# Altium schematic sheet schematic.SchDoc
size A4
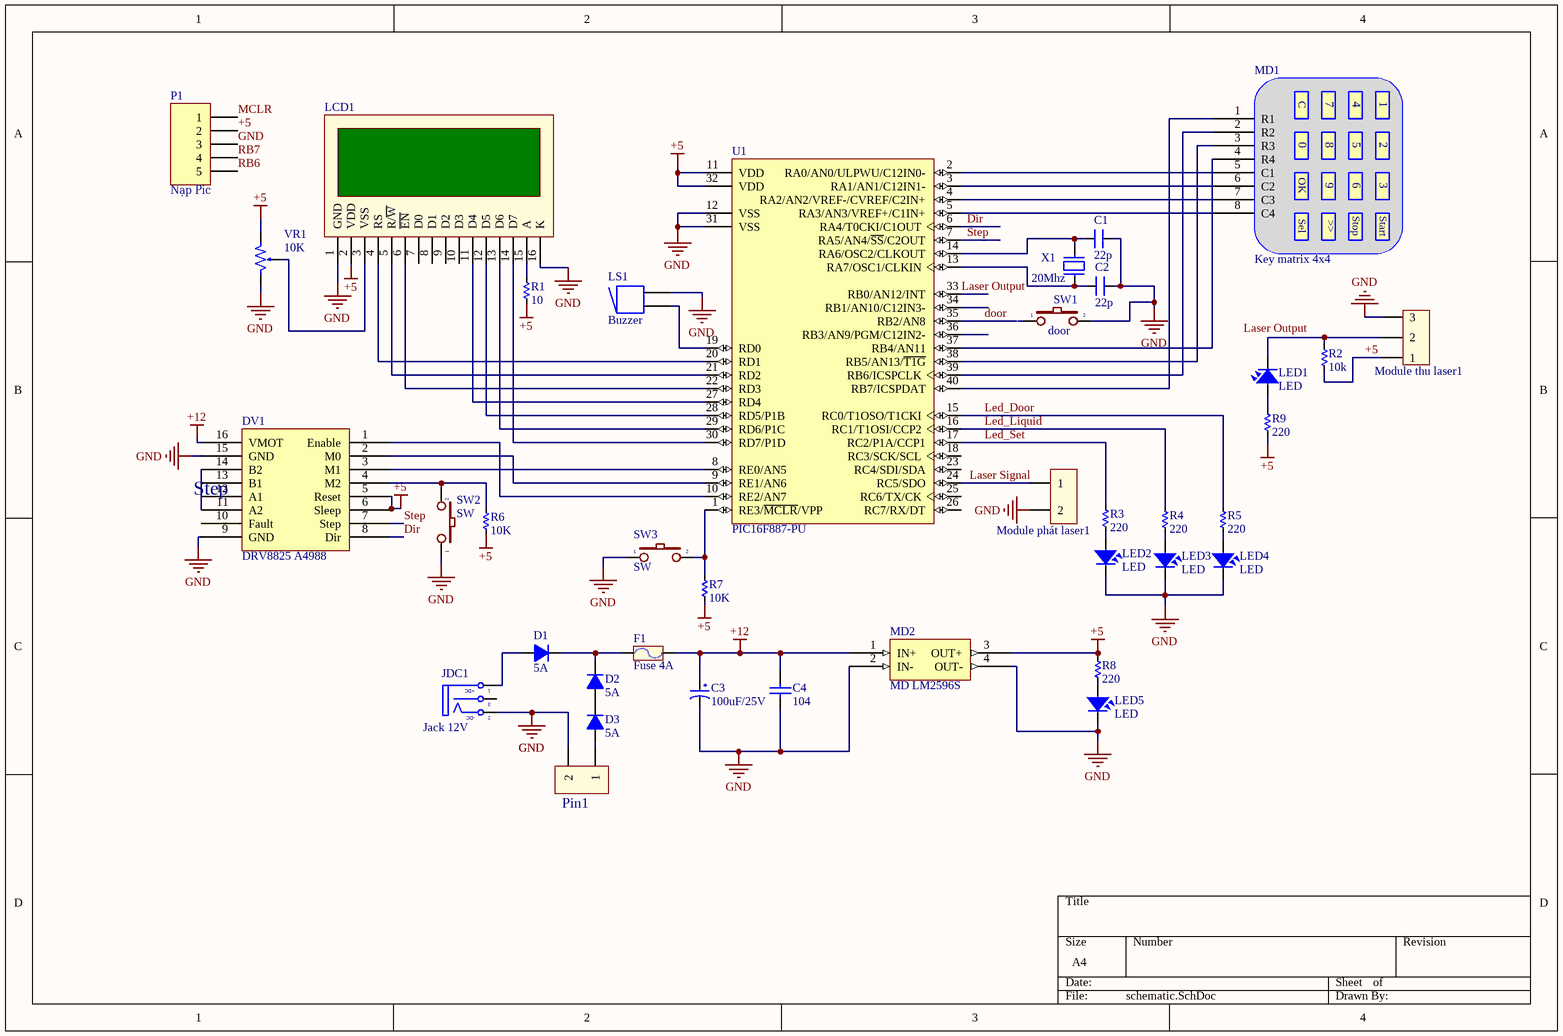
[diagram p0: schematic.SchDoc]

## Parts
C1  22p  [CN2]
C2  22p  [CN2]
C3  100uF/25V  [tu hoa 4mm]
C4  104  [tu gom]
D1  5A  [D5A]
D2  5A  [D5A]
D3  5A  [D5A]
DV1  DRV8825 A4988  [DRV8825 A4988]
F1  Fuse 4A  [Fuse1]
JDC1  Jack 12V  [DC-IN]
LCD1  LCD 20x4A  [LCD20X4A]  (value not drawn)
LED1  LED  [LED-3]
LED2  LED  [LED-3]
LED3  LED  [LED-3]
LED4  LED  [LED-3]
LED5  LED  [LED-3]
LS1  Buzzer  [Buzzer]
MD1  Key matrix 4x4
MD2  MD LM2596S  [MD L2596]
Module_phát_laser1  Con2/Header2  [CON2-1]  (value not drawn)
Module_thu_laser1  Con3/Header3  [CON3-1]  (value not drawn)
P1  Nạp Pic  [Header 5]
Pin1  Con2/Header2  [Terminal Block2]  (value not drawn)
R1  10  [RES-1/2W]
R2  10k  [RES-1/2W]
R3  220  [RES-1/2W]
R4  220  [RES-1/2W]
R5  220  [RES-1/2W]
R6  10K  [RES-1/2W]
R7  10K  [RES-1/2W]
R8  220  [RES-1/2W]
R9  220  [RES-1/2W]
SW1  door  [SW1-DIP]
SW2  SW  [SW1-DIP]
SW3  SW  [SW1-DIP]
U1  PIC16F887-PU  [DIP40/W0.6]
VR1  10K  [VR]
X1  20Mhz  [XT2]

## Nets
+5: DV1.5(Reset) DV1.6(Sleep) LCD1.2(VDD) MD2.3(OUT+) Module_thu_laser1.1 P1.2 R1.2 R2.1 R6.1 R7.2 R8.1 R9.2 U1.11(VDD) U1.32(VDD) VR1.1
+12: C3.1 C4.1 DV1.16(VMOT) F1.2 MD2.1(IN+)
GND: C1.2 C2.2 C3.2 C4.2 DV1.9(GND) DV1.15(GND) JDC1.2(TN) LCD1.1(GND) LCD1.16(K) LED2.2 LED3.2 LED4.2 LED5.2 LS1.2 MD2.2(IN-) MD2.4(OUT-) Module_phát_laser1.2 Module_thu_laser1.3 P1.3 Pin1.2 SW1.2 SW2.1 SW3.1 U1.12(VSS) U1.31(VSS) VR1.3
Dir: DV1.8(Dir) U1.6(RA4/T0CKI/C1OUT)
door: U1.35(RB2/AN8)
Laser Output: U1.33(RB0/AN12/INT)
Laser Signal: Module_phát_laser1.1 U1.24(RC5/SDO)
Led_Door: R5.1 U1.15(RC0/T1OSO/T1CKI)
Led_Liquid: R4.1 U1.16(RC1/T1OSI/CCP2)
Led_Set: R3.1 U1.17(RC2/P1A/CCP1)
MCLR: P1.1
RB6: P1.5
RB7: P1.4
Step: DV1.7(Step) U1.7(RA5/AN4/~{SS}/C2OUT)
NetC1_1: C1.1 U1.14(RA6/OSC2/CLKOUT) X1.1
NetC2_1: C2.1 U1.13(RA7/OSC1/CLKIN) X1.2
NetD1_1: D1.1(A) JDC1.1(T)
NetD1_2: D1.2(K) D2.2(K) F1.1
NetD2_1: D2.1(A) D3.2(K)
NetD3_1: D3.1(A) Pin1.1
NetDV1_1: DV1.1(Enable) U1.10(RE2/AN7)
NetDV1_2: DV1.2(M0) U1.9(RE1/AN6)
NetDV1_3: DV1.3(M1) U1.8(RE0/AN5)
NetDV1_4: DV1.4(M2) R6.2 SW2.2
NetLCD1_3: LCD1.3(VSS) VR1.2
NetLCD1_4: LCD1.4(RS) U1.20(RD1)
NetLCD1_5: LCD1.5(R/~{W}) U1.21(RD2)
NetLCD1_6: LCD1.6(~{EN}) U1.22(RD3)
NetLCD1_11: LCD1.11(D4) U1.27(RD4)
NetLCD1_12: LCD1.12(D5) U1.28(RD5/P1B)
NetLCD1_13: LCD1.13(D6) U1.29(RD6/P1C)
NetLCD1_14: LCD1.14(D7) U1.30(RD7/P1D)
NetLCD1_15: LCD1.15(A) R1.1
NetLED1_1: LED1.1 R9.1
NetLED1_2: LED1.2 Module_thu_laser1.2 R2.2
NetLED2_1: LED2.1 R3.2
NetLED3_1: LED3.1 R4.2
NetLED4_1: LED4.1 R5.2
NetLED5_1: LED5.1 R8.2
NetLS1_1: LS1.1 U1.19(RD0)
NetMD1_1: MD1.1(R1) U1.40(RB7/ICSPDAT)
NetMD1_2: MD1.2(R2) U1.39(RB6/ICSPCLK)
NetMD1_3: MD1.3(R3) U1.38(RB5/AN13/~{T1G})
NetMD1_4: MD1.4(R4) U1.37(RB4/AN11)
NetMD1_5: MD1.5(C1) U1.2(RA0/AN0/ULPWU/C12IN0-)
NetMD1_6: MD1.6(C2) U1.3(RA1/AN1/C12IN1-)
NetMD1_7: MD1.7(C3) U1.4(RA2/AN2/VREF-/CVREF/C2IN+)
NetMD1_8: MD1.8(C4) U1.5(RA3/AN3/VREF+/C1IN+)
NetR7_1: R7.1 SW3.2 U1.1(RE3/~{MCLR}/VPP)

Not connected (* = marked no-connect by the designer): DV1 10(Fault) 11(A2) 12(A1) 13(B1) 14(B2); JDC1 3(S); LCD1 7(D0) 8(D1) 9(D2) 10(D3); SW1 1; U1 18(RC3/SCK/SCL) 23(RC4/SDI/SDA) 25(RC6/TX/CK) 26(RC7/RX/DT) 34(RB1/AN10/C12IN3-) 36(RB3/AN9/PGM/C12IN2-)

## Notes on the sheet
- (near DV1) Step
- Labels drawn without touching a wire or pin: Laser Output
- (in symbol Jac_DC) +DC; -DC
- (in symbol key matrix 4x4) C; 0; OK; 9; Sel; >>; Stop; Start

## Library data of the parts
C1 C2 = CN2: Cap np 104 => 105pF; Value: 0.1uF
C3 = Tu Hoa 10uF 16V 4x7: Cắm; So_Chan: 2; Don_Vi: Con; Ten_Linh_Kien: Tụ Hóa 10uF 16V; Ma_Hang: MH006855; Chung_Loai: Cắm; Kieu_Chan: *
C4 = Tu gom 104 50V: Cắm; So_Chan: 2; Ten_Linh_Kien: Tụ gốm 104 100nF 50V; Don_Vi: Con; Ma_Hang: MH004761; Chung_Loai: Cắm; Kieu_Chan: *
D1-D3 = D5A: Diode 5A; Value: 1N5408
F1 = Fuse: Designed by: VanDungEvn; Value: Fuse
JDC1 = Jac_DC: Cắm; Ten_Linh_Kien: Jack DC5.5x2.1MM DC5501; Ma_Hang: MH000923; Don_Vi: Con; Kieu_Chan: *; Ghi_Chu: *; Chung_Loai: Cắm
LCD1 = LCD20x4A: LCD dipslay 20 char, 4 line; Value: Jum 40; Value: LCD 20x4A
LED1-LED5 = LED: LED Single colour Green and Red; Value: LED 3 ly Single Colour
LS1 = Buzzer: Magnetic Transducer Buzzer; Published: 24-Mar-1999; LatestRevisionDate: 17-Dec-2003; LatestRevisionNote: Schematic revised, PCB Footprint replaced.; DatasheetDocument: 17-Dec-2003; PackageReference: ABSM-1574; Publisher: Altium Limited; ComponentLink1Description: Manufacturer Link; ComponentLink1URL: http://www.megastar.com/linecard/buzzmode/index.php
MD2 = MD LM2596
Module_phát_laser1 Pin1 = Con2/Header2: CON2
Module_thu_laser1 = Con3/Header3: CON3
P1 = Header 5: Header, 5-Pin; LatestRevisionDate: 17-Jul-2002; LatestRevisionNote: Re-released for DXP Platform.; Publisher: Altium Limited
R1-R9 = Res: Manufacturer: Generic Components; Class: Passive; SubClass: R; Published: 08/06/2000; Publisher: Altium Hobart Technology Centre
SW1-SW3 = SW2: Switch button 2 pin; Value: SW chip 2 pin
U1 = PIC16F887-PU: Flash-Based, 8-Bit CMOS Microcontroller with nanoWatt Technology, 8K (x14-Bit words) Program Memory, 624 Bytes Data Memory, 35 I/O pins, 40-Pin PDIP, Standard VDD Range, Extended Temperature; Published: 29-Jan-2009; LatestRevisionDate: 02-Dec-2009; LatestRevisionNote: Updated datasheet to version revF, Apr-2009.; DatasheetVersion: revF, Apr-2009; PackageVersion: revBB, Aug-2009; PackageReference: PDIP600-P40; Publisher: Altium Limited; PackageDescription: 40-Lead Plastic Dual In-Line (P) - 600 mil Body [PDIP]; Supplier 1: Digi-Key; Supplier Part Number 1: PIC16F887-E/P-ND; Supplier 2: Farnell; Supplier Part Number 2: 1703423; ComponentLink1Description: Datasheet; ComponentLink1URL: http://ww1.microchip.com/downloads/en/DeviceDoc/41291F.pdf; ComponentLink2Description: Packaging Specification; ComponentLink2URL: http://www.microchip.com/stellent/groups/techpub_sg/documents/packagingspec/en012702.pdf; ComponentLink3Description: Microchip.com Home; ComponentLink3URL: http://www.microchip.com/
VR1 = VR1: Var Resistor; Value: VR 10K
X1 = XT2: Crystal For all Crystal 2pin.; Value: 4Mhz